# Altium schematic sheet IMU.SchDoc
size A4
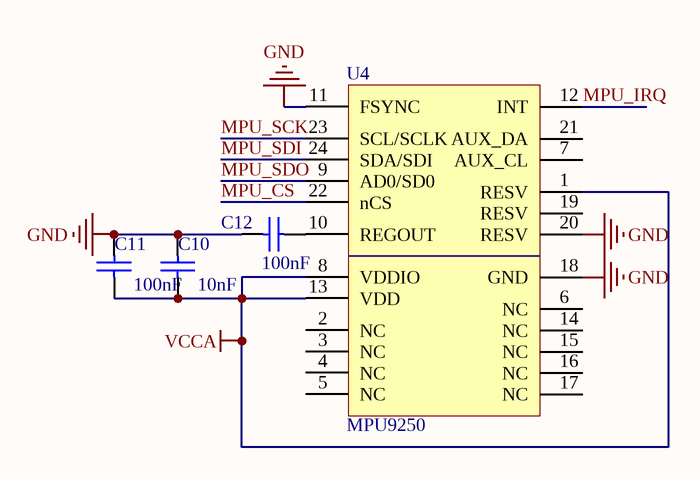
[diagram p0: IMU.SchDoc]

## Parts
C10  10nF  [0402C]
C11  100nF  [0402C]
C12  100nF  [0402C]
U4  MPU9250  [QFN24-0.4]

## Nets
GND: C10.2 C11.2 C12.1 U4.11(FSYNC) U4.18(GND) U4.20(RESV)
VCCA: C10.1 C11.1 U4.1(RESV) U4.8(VDDIO) U4.13(VDD)
MPU_CS: U4.22(nCS)
MPU_IRQ: U4.12(INT)
MPU_SCK: U4.23(SCL/SCLK)
MPU_SDI: U4.24(SDA/SDI)
MPU_SDO: U4.9(AD0/SD0)
NetC12_2: C12.2 U4.10(REGOUT)

Not connected (* = marked no-connect by the designer): U4 2(NC) 3(NC) 4(NC) 5(NC) 6(NC) 7(AUX_CL) 14(NC) 15(NC) 16(NC) 17(NC) 19(RESV) 21(AUX_DA)

## Library data of the parts
C10-C12 = cap: 贴片电阻